# EAGLE design GSRv3.2 (EAGLE 7.4.0)
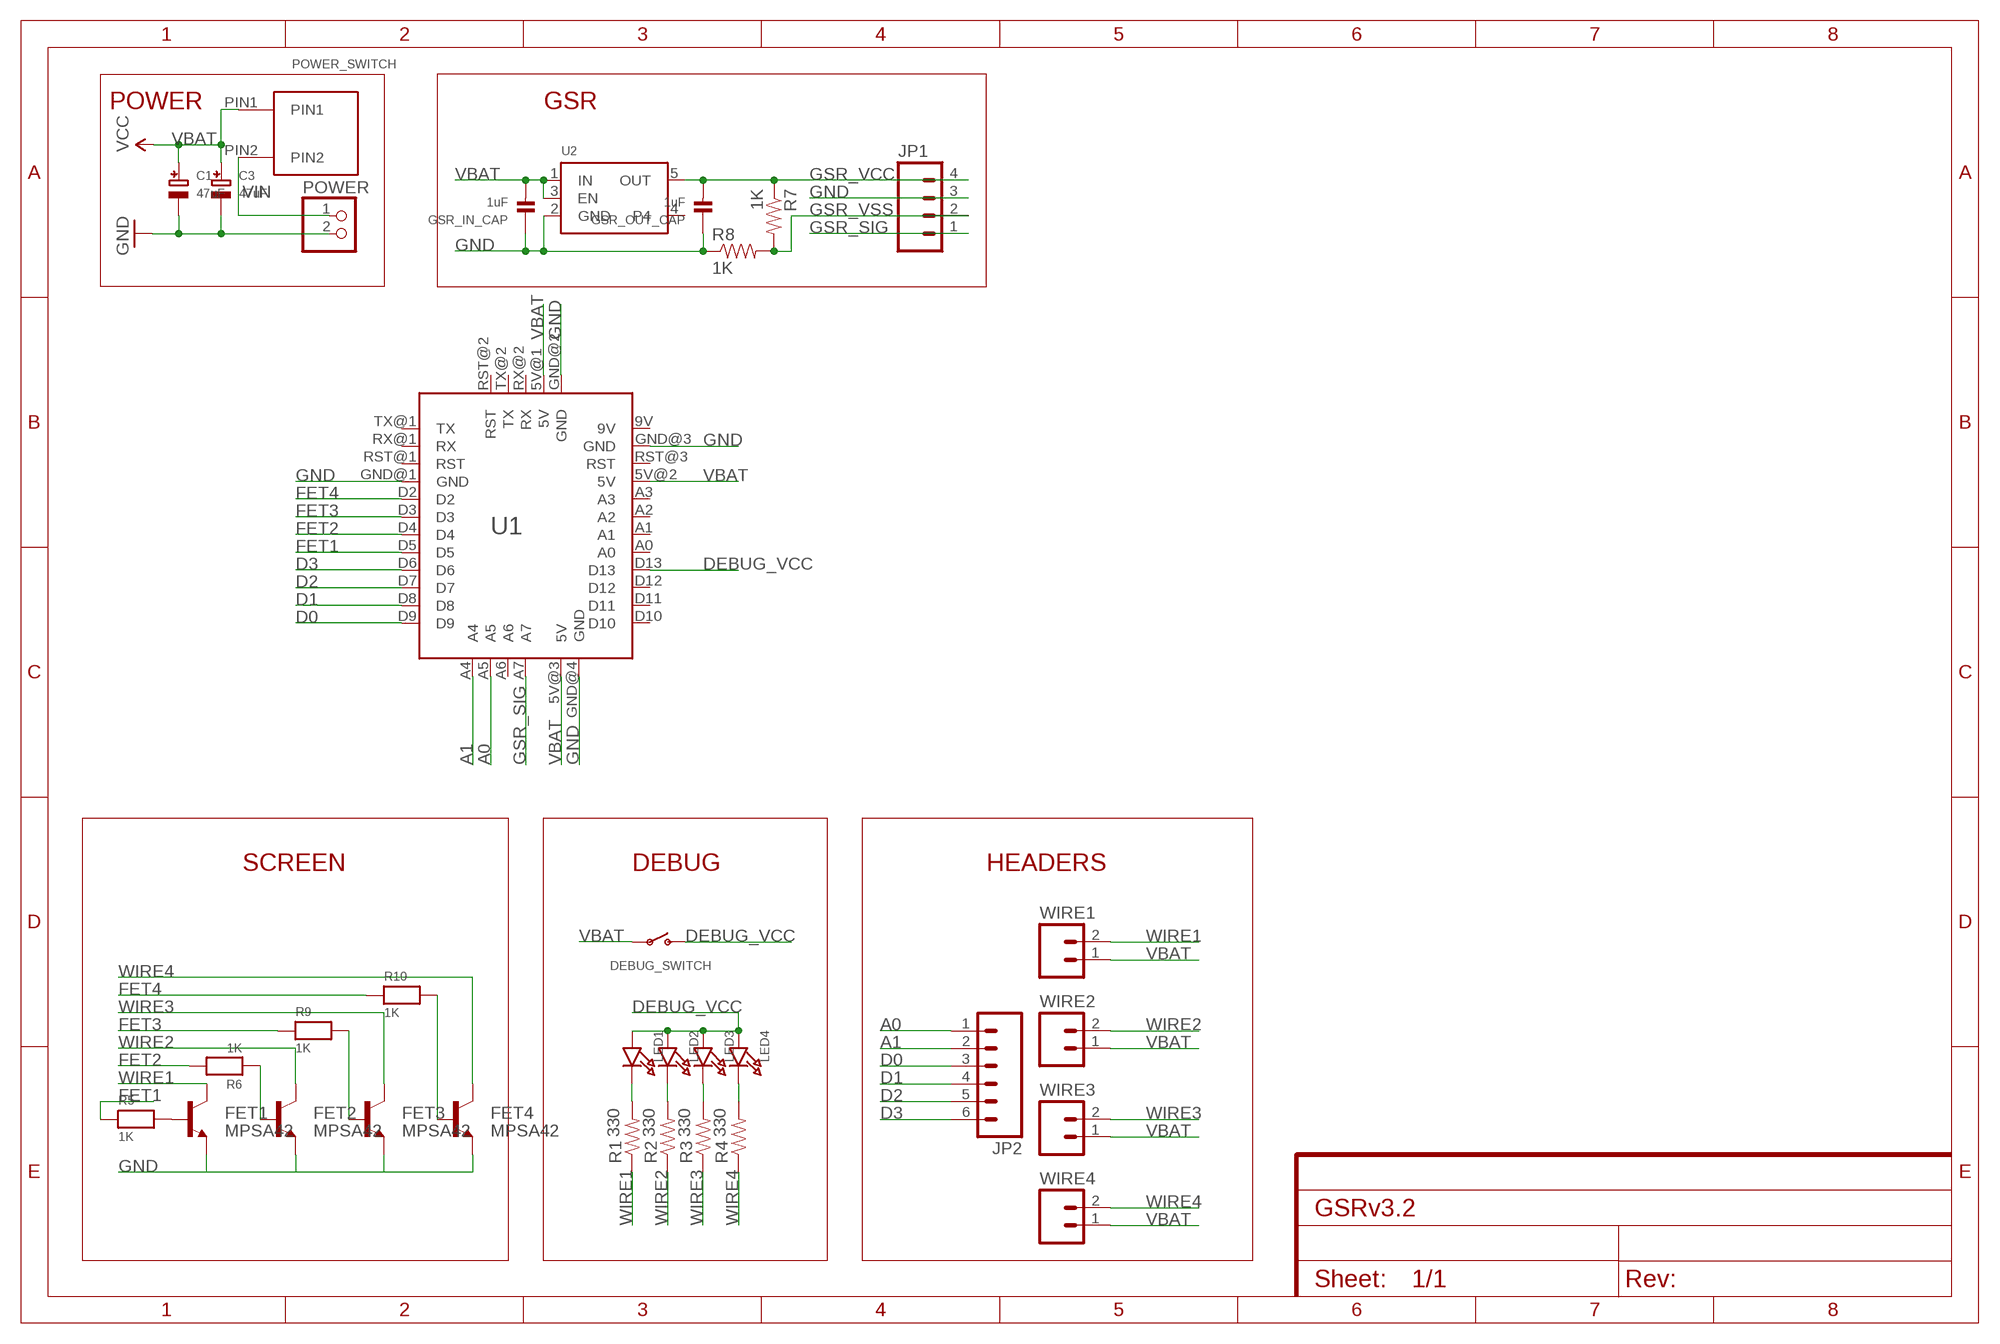
[diagram p0: schematic, sheet 1]

## Parts
C1  47uF  CAP_TANTALUMB/3528_WAVE  [EIA3528-21/B-W]
C3  47uF  CAP_TANTALUMB/3528_WAVE  [EIA3528-21/B-W]
DEBUG_SWITCH  SWITCH_SPST  [SPST_SMT_19192]
FET1  MPSA42  TRANSISTOR_NPNMPSA42  [SOT23-3]
FET2  MPSA42  TRANSISTOR_NPNMPSA42  [SOT23-3]
FET3  MPSA42  TRANSISTOR_NPNMPSA42  [SOT23-3]
FET4  MPSA42  TRANSISTOR_NPNMPSA42  [SOT23-3]
GSR_IN_CAP  1uF  CAP_CERAMIC0603  [0603]
GSR_OUT_CAP  1uF  CAP_CERAMIC0603  [0603]
JP1  M04POLAR  [MOLEX-1X4]
JP2  M06SILK_FEMALE_PTH  [1X06]
LED1  LED0603_NOOUTLINE  [CHIPLED_0603_NOOUTLINE]
LED2  LED0603_NOOUTLINE  [CHIPLED_0603_NOOUTLINE]
LED3  LED0603_NOOUTLINE  [CHIPLED_0603_NOOUTLINE]
LED4  LED0603_NOOUTLINE  [CHIPLED_0603_NOOUTLINE]
POWER  JST_2PIN  [JSTPH2]
POWER_SWITCH  PUSH_BUTTON  [PUSH_BUTTON]
R1  330  RESISTOR0603-RES  [0603-RES]
R2  330  RESISTOR0603-RES  [0603-RES]
R3  330  RESISTOR0603-RES  [0603-RES]
R4  330  RESISTOR0603-RES  [0603-RES]
R5  1K  RESISTOR0603  [0603]
R6  1K  RESISTOR0603  [0603]
R7  1K  0OHM-1/10W-5%(0603)  [0603]
R8  1K  0OHM-1/10W-5%(0603)  [0603]
R9  1K  RESISTOR0603  [0603]
R10  1K  RESISTOR0603  [0603]
U1  ARDUINO_MINI  [ARDUINO_MINI]
U2  VREG_SOT23-5  [SOT23-5]
WIRE1  M02POLAR  [MOLEX-1X2]
WIRE2  M02POLAR  [MOLEX-1X2]
WIRE3  M02POLAR  [MOLEX-1X2]
WIRE4  M02POLAR  [MOLEX-1X2]

## Nets
A0: JP2.1 U1.A5
A1: JP2.2 U1.A4
D0: JP2.3 U1.D9
D1: JP2.4 U1.D8
D2: JP2.5 U1.D7
D3: JP2.6 U1.D6
DEBUG_VCC: DEBUG_SWITCH.C(S) LED1.A LED2.A LED3.A LED4.A U1.D13
FET1: R5.1 U1.D5
FET2: R6.2 U1.D4
FET3: R9.1 U1.D3
FET4: R10.1 U1.D2
GND: C1.- C3.- FET1.2(E) FET2.2(E) FET3.2(E) FET4.2(E) GSR_IN_CAP.1 GSR_OUT_CAP.1 JP1.3 POWER.2 R8.1 U1.GND@1(GND) U1.GND@2(GND) U1.GND@3(GND) U1.GND@4(GND) U2.2(GND)
GSR_SIG: JP1.1 U1.A7
GSR_VCC: GSR_OUT_CAP.2 JP1.4 R7.1 U2.5(OUT)
GSR_VSS: JP1.2 R7.2 R8.2
N$1: LED1.C R1.2
N$2: LED2.C R2.2
N$3: LED3.C R3.2
N$4: LED4.C R4.2
N$5: FET1.1(B) R5.2
N$6: FET2.1(B) R6.1
N$7: FET3.1(B) R9.2
N$8: FET4.1(B) R10.2
VBAT: C1.+ C3.+ DEBUG_SWITCH.B(P) GSR_IN_CAP.2 POWER_SWITCH.PIN1 U1.5V@1(5V) U1.5V@2(5V) U1.5V@3(5V) U2.1(IN) U2.3(EN) WIRE1.1 WIRE2.1 WIRE3.1 WIRE4.1 ; supply symbol labelled VCC
VIN: POWER.1 POWER_SWITCH.PIN2
WIRE1: FET1.3(C) R1.1 WIRE1.2
WIRE2: FET2.3(C) R2.1 WIRE2.2
WIRE3: FET3.3(C) R3.1 WIRE3.2
WIRE4: FET4.3(C) R4.1 WIRE4.2
Unconnected: U1.A0 U1.A1 U1.A2 U1.A3 U1.A6 U1.D10 U1.D11 U1.D12 U1.RST@1(RST) U1.RST@2(RST) U1.RST@3(RST) U1.RX@1(RX) U1.RX@2(RX) U1.TX@1(TX) U1.TX@2(TX) U2.4

## Notes on the sheet
- POWER | GSR
- SCREEN | DEBUG | HEADERS

## Power pins joined to a net without a drawn wire
9V: U1.9V

## Library data of the parts
C1 C3 = microbuilder:CAP_TANTALUM: Tantalum Capacitors Wave footprints have larger pads and are meant to be used for hand soldering. Reflow footprints are optimised for solder paste and a reflow oven. EIA3216-18/A-[R/W] - Size A / 3216-18 / 1206 footprint 4.7µF 25V 10% Tantalum Capacitor 10µF 16V 10% Tantalum Capacitor [Digikey: 495-2236-2-ND] EIA3528-21/B-[R/W] - Size B / 3528-21 47µF 10V 10% Tantalum Capactior [Digikey: 495-2216-1-ND] EIA6032-28/C-[R/W] - Size C / 6032-28 10µF 35V 20% Tantalum Capacitor [Digikey: 495-2285-1-ND] 100µF 16V 10% Tantalum Capactior [Digikey: 399-5214-1-ND]
DEBUG_SWITCH = microbuilder:SWITCH_SPST: Switch - SPST 4UCon 19192 (6.7x2.6mm SMT)
FET1-FET4 = SparkFun-DiscreteSemi:TRANSISTOR_NPN: Generic NPN BJT MMBT2222A - TRANS-08049 (SOT-23, 1A 40V) MPSA42 - TRANS-09116 (SOT-23, 500mA 300V) MMBT5088LT1G - TRANS-11160 (SOT-23, 50 mA 30V) BC547 - COM-08928 <http://www.sparkfun.com/products/8928> (TO-92 45V 100mA) (1.Collector 2.Base 3.Emitter) 2N3904 - COM-00521 <http://www.sparkfun.com/products/521> (TO-92 40V 200mA) (1.Emitter 2.Base 3.Collector) P2N2222A - COM-12852 <http://www.sparkfun.com/products/12852> (TO-92 40V 600mA) (1.Collector 2.Base 3.Emitter); PROD_ID: TRANS-09116
GSR_IN_CAP GSR_OUT_CAP = microbuilder:CAP_CERAMIC: Ceramic Capacitors 0402 - 0402 Surface Mount Capacitors 16pF 50V 5% [Digikey: 445-4899-2-ND] 18pF 50V 5% [Digikey: 490-1281-2-ND] 22pF 50V 5% [Digikey: 490-1283-2-ND] 68pF 50V 5% [Digikey: 490-1289-2-ND] 0.1uF 10V 10% [Digikey: 490-1318-2-ND] 1.0uF 6.3V 10% [Digikey: 490-1320-2-ND] 0603 - 0603 Surface Mount Capacitors 16 pF 50V 5% [Digikey: 445-5051-2-ND] 22 pF 50V [Digikey: PCC220ACVTR-ND] 33 pF 50V 5% [Digikey: 490-1415-1-ND] 56pF 50V 5% [Digikey: 490-1421-1-ND] 220pF 50V 5% [Digikey: 445-1285-1-ND] 680 pF 50V 2200 pF 50V 5% C0G [Digikey: 445-1297-1-ND] 5600 pF 100V 5% X7R [Digikey: 478-3711-1-ND] 0.1 µF 25V 10% [Digikey: PCC2277TR-ND] 0.22 µF 16V 10% X7R [Digikey: 445-1318-1-ND] 1.0 µF 25V 10% [Digikey: 445-5146-2-ND] 0603 - RF Specific 3pF 250V +/-0.1pF RF [Digikey: 712-1347-1-ND] 18 pF 250V 5% [Digikey: 478-3505-1-ND or 712-1322-1-ND] 56 pF 250V 5% C0G RF [Digikey: 490-4867-1-ND] 68 pF 250V RF [Digikey: 490-4868-1-ND] 0805 - 0805 Surface Mount Capacitors 220 pF 250V 2% RF Ceramic Capacitor [Digikey: 712-1398-1-ND] 1000 pF 50V 2% NP0 Ceramic Capacitor [Digikey: 478-3760-1-ND] 0.1 µF 25V 10% Ceramic Capacitor [Digikey: PCC1828TR-ND] 1.0 µF 16V 10% Ceramic Capacitor[Digikey: 490-1691-2-ND] 10.0 µF 10V 10% Ceramic Capacitor[Digikey: 709-1228-1-ND] 10.0 uF 16V 10% Ceramic Capacitor [Digikey: 478-5165-2-ND] 47 uF 6.3V 20% Ceramic Capacitor [Digikey: 587-1779-1-ND or 399-5506-1-ND] 1206 - 1206 Surface Mount Capacitors 47uF 10V 20% Ceramic Capacitor [Digikey: 490-5528-1-ND or 399-5508-1-ND or 445-6010-1-ND] 100uF 6.3V -20%, +80% Y5V Ceramic Capacitor (Digikey: 490-4512-1-ND, Mouser: 81-GRM31CF50J107ZE1L)
JP1 = SparkFun-Connectors:M04: Header 4 Standard 4-pin 0.1" header. Use with straight break away headers (SKU : PRT-00116), right angle break away headers (PRT-00553), swiss pins (PRT-00743), machine pins (PRT-00117), and female headers (PRT-00115). Molex polarized connector foot print use with SKU : PRT-08231 with associated crimp pins and housings. 1MM SMD Version SKU: PRT-10208
JP2 = SparkFun-Connectors:M06: Header 6 Standard 6-pin 0.1" header. Use with straight break away headers (SKU : PRT-00116), right angle break away headers (PRT-00553), swiss pins (PRT-00743), machine pins (PRT-00117), and female headers (PRT-00115). Molex polarized connector foot print use with SKU : PRT-08094 with associated crimp pins and housings. NOTES ON THE VARIANTS LOCK and LOCK_LONGPADS... This footprint was designed to help hold the alignment of a through-hole component (i.e. 6-pin header) while soldering it into place. You may notice that each hole has been shifted either up or down by 0.005 of an inch from it's more standard position (which is a perfectly straight line). This slight alteration caused the pins (the squares in the middle) to touch the edges of the holes. Because they are alternating, it causes a "brace" to hold the component in place. 0.005 has proven to be the perfect amount of "off-center" position when using our standard breakaway headers. Although looks a little odd when you look at the bare footprint, once you have a header in there, the alteration is very hard to notice. Also,if you push a header all the way into place, it is covered up entirely on the bottom side. This idea of altering the position of holes to aid alignment will be further integrated into the Sparkfun Library for other footprints. It can help hold any component with 3 or more connection pins.; PROD_ID: CONN-08437
LED1-LED4 = microbuilder:LED: LED 0603 - 0603 Surface Mount Package 2mA: Green LED - Low Power (3.9mcd, 2ma, 1.7Vf) - Digikey: 475-2709-2-ND Orange LED - Low Power (9.8mcd, 2ma, 1.8Vf) - Digikey: 475-1194-2-ND Red LED - Low Power (5mcd, 2ma, 1.8Vf) - Digikey: 475-1195-2-ND Yellow LED - Low Power (7mcd, 2ma, 1.8Vf) - Digikey: 475-1196-2-ND 5mA: Blue LED - Low Power (17mcd, 5ma, 2.9Vf) - Digikey: LNJ937W8CRACT-ND 0805 - 0805 Surface Mount Package 2mA: Red LED (8.8mcd, 2mA, 1.8Vf, Clear) - Low Power [Digikey: 475-2510-1-ND] Green LED (5mcd, 2mA, 1.8Vf, Clear) - Low Power [Digikey: 475-2730-1-ND] Yellow LED (11.3mcd, 2mA, 1.8Vf, Clear) - Low Power [Digikey: 475-2555-1-ND] 20mA: Red LED (104mcd, 20mA, Diffused) - LS R976 [Digikey: 475-1278-6-ND] Red LED (12mcd, 20mA, 2.0Vf, Clear) - APT2012EC [Digikey: 754-1128-1-ND] Green LED (15mcd, 20mA, 2.2Vf, Clear) - APT2012GC [Digikey: 754-1131-1-ND] Orange LED (160mcd, 20mA, 2.1Vf, Clear) - APT2012SECK [Digikey: 754-1130-1-ND] 1206 - 1206 Surface Mount Package Green LED (26mcd, 20mA, Diffused) - LG N971 [Digikey: 475-1407-6-ND] Red LED (15mcd, 20mA, Diffused) - LH N974 [Digikey: 475-1416-6-ND]
POWER = microbuilder:JST_2PIN: JST 2-Pin Right-Angle Connector PH-Series - 4UConnector: 17311 SH-Series - 4UConnector: 07278
POWER_SWITCH = myParts:PUSH_BUTTON
R1-R4 = SparkFun-Passives:RESISTOR: Resistor Basic schematic elements and footprints for 0603, 1206, and PTH resistors.
R5 R6 R9 R10 = microbuilder:RESISTOR: Resistors 0402 - 0402 Surface Mount Package 22 Ohm 1% 1/16W [Digikey: 311-22.0LRTR-ND] 33 Ohm 5% 1/16W 1.0K 5% 1/16W 1.5K 5% 1/16W 2.0K 1% 1/16W 10.0K 1% 1/16W [Digikey: 311-10.0KLRTR-ND] 10.0K 5% 1/16W [Digikey: RMCF0402JT10K0TR-ND] 12.1K 1% 1/16W [Digikey: 311-22.0LRTR-ND] 100.0K 5% 1/16W 0603 - 0603 Surface Mount Package 0 Ohm 1/10 Watt 1% Resistor 15 Ohm 1/10 Watt 1% Resistor 33 Ohm 1/10 Watt 1% Resistor 49.9 Ohm 1/10 Watt 1% Resistor 100 Ohm 1/10 Watt 1% Resistor 150 Ohm 1/10 Watt 1% Resistor 240 Ohm 1/10 Watt 1% Resistor 390 Ohm 1/10 Watt 1% Resistor 560 Ohm 1/10 Watt 1% Resistor 680 Ohm 1/10 Watt 1% Resistor 750 Ohm 1/10 Watt 1% Resistor 1.0K Ohm 1/10 Watt 1% Resistor 1.5K Ohm 1/10 Watt 1% Resistor 2.0K Ohm 1/10 Watt 1% Resistor 2.2K Ohm 1/10 Watt 1% Resistor 3.3K Ohm 1/10 Watt 1% Resistor 4.7K Ohm 1/10 Watt 1% Resistor 10.0K Ohm 1/10 Watt 1% Resistor 12.0K Ohm 1/10 Watt 1% Resistor 12.1K Ohm 1/10 Watt 1% Resistor 20.0K Ohm 1/10 Watt 1% Resistor 33.0K Ohm 1/10 Watt 1% Resistor 100.0K Ohm 1/10 Watt 1% Resistor 0805 - 0805 Surface Mount Package 0 Ohm 1/8 Watt 1% Resistor 33 Ohm 1/8 Watt 1% Resistor 100 Ohm 1/8 Watt 1% Resistor 150 Ohm 1/8 Watt 1% Resistor 200 Ohm 1/8 Watt 1% Resistor 240 Ohm 1/8 Watt 1% Resistor 330 Ohm 1/8 Watt 1% Resistor 390 Ohm 1/8 Watt 1% Resistor 470 Ohm 1/8 Watt 1% Resistor 1.0K Ohm 1/8 Watt 1% Resistor 1.5K Ohm 1/8 Watt 1% Resistor 2.0K Ohm 1/8 Watt 1% Resistor 4.7K Ohm 1/8 Watt 1% Resistor 5.1K Ohm 1/8 Watt 1% Resistor 5.6K Ohm 1/8 Watt 1% Resistor 10.0K Ohm 1/8 Watt 1% Resistor 22.0K Ohm 1/8 Watt 1% Resistor 33.0K Ohm 1/8 Watt 1% Resistor 100K Ohm 1/8 Watt 1% Resistor 1206 - 1206 Surface Mount Package 2012 - 2010 Surface Mount Package 0.11 Ohm 1/2 Watt 1% Resistor - Digikey: RHM.11UCT-ND
R7 R8 = SparkFun-Resistors:0OHM-1/10W-5%(0603): RES-08609; PROD_ID: RES-08609; VALUE: 0
U1 = myParts:ARDUINO_MINI: Arduino Mini V5 Footprint
U2 = microbuilder:VREG_SOT23-5: SOT23-5 Fixed Voltage Regulators To better organise some of the SOT23-5 fixed voltage regulators in this library, this new part was created. Part Current Out V Out V In V Dropout Digikey Part No. ADP121 150mA 3.3V 3.4-5.5V 0.09V @ 150mA ADP121-AUJZ33R7CT-ND ADP121 150mA 3.0V 3.1-5.5V 0.09V @ 150mA ADP121-AUJZ30R7CT-ND ADP122 300mA 3.3V 3.4-5.5V 0.085V @ 300mA ADP122AUJZ-3.3-R7CT-ND ADP1712 300mA 3.3V 3.5-5.5V 0.17V @ 300mA ADP1712AUJZ-3.3-R7TR-ND AP7311 (Low Cost) 150mA 3.3V 3.5-6V 0.15V @ 150mA AP7311-33WG-7DICT-ND LD39015M18R 150mA 1.8V 1.9V-5.5V 0.08V @ 100mA 497-6977-1-ND MCP1824T-3302E/OT 300mA 3.3V 3.5V-6V 0.2V @ 300mA MCP1824T-3302E/OTCT-ND MIC5205-2.5YM5 TR 150mA 2.5V 2.7-16V 0.165V @ 150mA 576-1257-2-ND MIC5205-3.0YM5 TR 150mA 3.0V 3.2V-16V 0.165V @ 150mA 576-1258-2-ND MIC5205-3.3YM5 TR 150mA 3.3V 3.5V-16V 0.165V @ 150mA 576-1259-2-ND TPS780330220 150mA 3.3V+2.2V 3.6-5.5V 250mV Max 296-23332-1-ND TDA3663/N1,135 100mA 3.3V 3.5-45V 0.18V @ 50mA 568-5343-1-ND
WIRE1-WIRE4 = SparkFun-Connectors:M02: Standard 2-pin 0.1" header. Use with - straight break away headers ( PRT-00116) - right angle break away headers (PRT-00553) - swiss pins (PRT-00743) - machine pins (PRT-00117) - female headers (PRT-00115) Molex polarized connector foot print use with: PRT-08233 with associated crimp pins and housings. 2.54_SCREWTERM for use with PRT-10571. 3.5mm Screw Terminal footprints for PRT-08084 5mm Screw Terminal footprints for use with PRT-08432

## Board
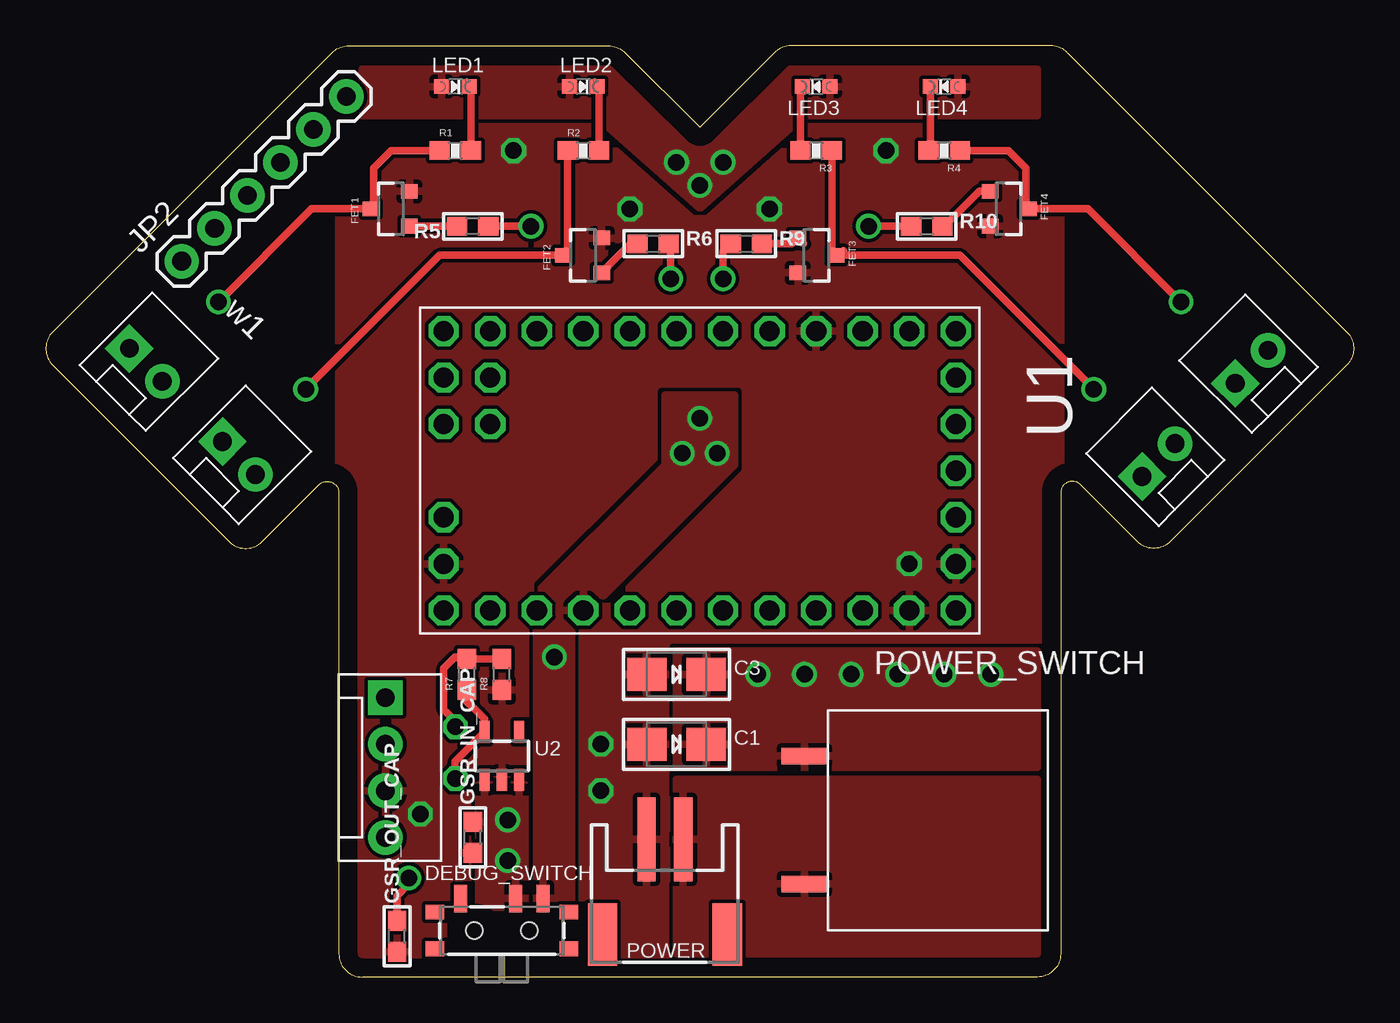
[diagram p1: board, top side]
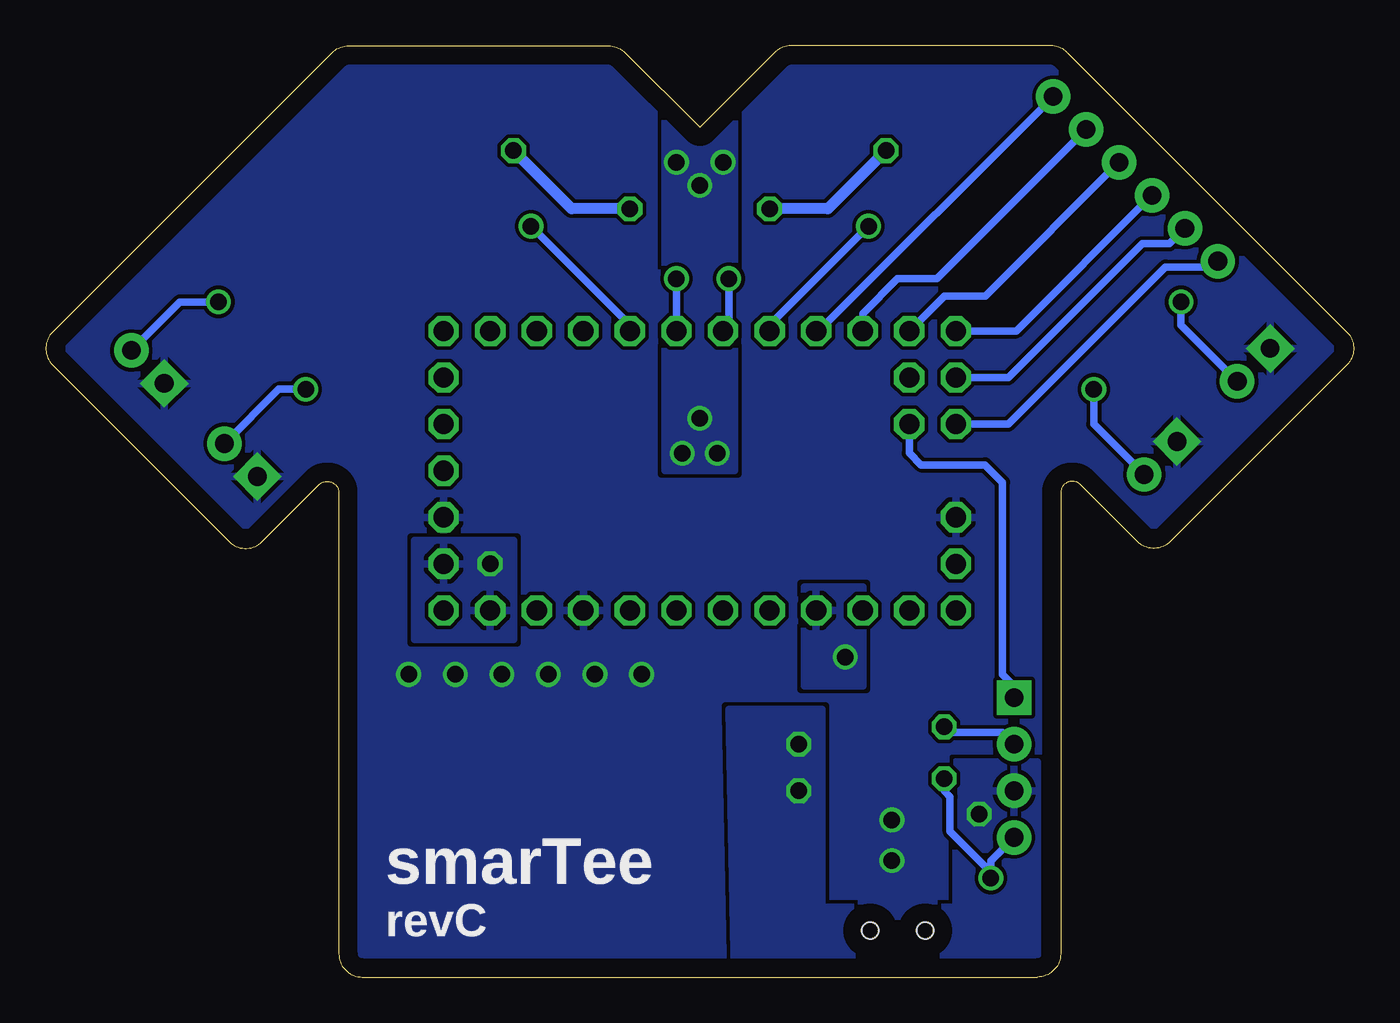
[diagram p2: board, bottom side, seen from below]

Size 71.34 x 50.8 mm. Coordinates in mm from the lower left corner, seen from the top.
Outline: 56.44,26.86 arc135 55.35,26.41 55.35,1.27 arc-90 54.08,0 17.25,0 arc-90 15.98,1.27 15.98,26.41 arc135 14.9,26.86 11.8,23.76 arc-90 10,23.76 0.37,33.39 arc-90 0.37,35.19 15.61,50.43 arc-45 16.51,50.8 30.7,50.8 arc-45 31.59,50.43 35.67,46.36 39.74,50.43 arc-45 40.64,50.8 54.83,50.8 arc-45 55.72,50.43 70.96,35.19 arc-90 70.96,33.39 61.33,23.76 arc-90 59.53,23.76 56.44,26.86
Copper layers (1*16): Top 0.035mm / dielectric 1.5mm / Bottom 0.035mm
Design rules "default": minimum track width 10mil, minimum drill 24mil, track to track 8mil, track to pad 8mil, pad to pad 8mil, via to via 8mil, smd to smd 8mil, copper to edge 40mil, drill to drill 8mil, minimum pad ring 10mil, minimum via ring 8mil, stop-mask expansion 4mil, vias tented up to drill 0mil, thermal gap 10mil

### Footprints (pad centres in the part's own frame; a part is rotated, then mirrored left to right if it is on the bottom)
EIA3528-21/B-W = smd 2.15 x 1.8: + 1.625,0; - -1.625,0
SPST_SMT_19192 = smd 0.7 x 1.5: A -2.25,1.75; B 0.75,1.75; C 2.25,1.75 | smd 1 x 0.8: GND1 -3.65,1; GND2 -3.65,-1; GND3 3.65,1; GND4 3.65,-1 | hole 0.9: -1.5,0; 1.5,0
SOT23-3 = smd 0.8 x 0.9: 1 -0.95,-1; 2 0.95,-1; 3 0,1.1
0603 = smd 1.1 x 1: 1 -0.85,0; 2 0.85,0
MOLEX-1X4 = drill 1.016 pad 1.88 square: 1 0,0 | drill 1.016 pad 1.88: 2 2.54,0; 3 5.08,0; 4 7.62,0
1X06 = drill 1.016 pad 1.88: 1 0,0; 2 2.54,0; 3 5.08,0; 4 7.62,0; 5 10.16,0; 6 12.7,0
CHIPLED_0603_NOOUTLINE = smd 0.8 x 0.8: A 0,-0.75; C 0,0.75
JSTPH2 = smd 1 x 4.6: 1 -1,-3.7; 2 1,-3.7 | smd 1.6 x 3.4: NC1 -3.4,1.5; NC2 3.4,1.5
PUSH_BUTTON = smd 2.5 x 0.9: PIN1 -13.97,-0.644; PIN2 -13.97,-7.62
0603-RES = smd 1.1 x 1: 1 -0.85,0; 2 0.85,0
ARDUINO_MINI = drill 1.1 octagon: 5V@1 2.54,15.24; 5V@2 7.62,7.62; 5V@3 2.54,-12.7; 9V 7.62,15.24; A0 7.62,-2.54; A1 7.62,0; A2 7.62,2.54; A3 7.62,5.08; A4 -5.08,-12.7; A5 -2.54,-12.7; A6 -5.08,-10.16; A7 -2.54,-10.16; D2 -7.62,5.08; D3 -7.62,2.54; D4 -7.62,0; D5 -7.62,-2.54; D6 -7.62,-5.08; D7 -7.62,-7.62; D8 -7.62,-10.16; D9 -7.62,-12.7; D10 7.62,-12.7; D11 7.62,-10.16; D12 7.62,-7.62; D13 7.62,-5.08; GND@1 -7.62,7.62; GND@2 5.08,15.24; GND@3 7.62,12.7; GND@4 5.08,-12.7; RST@1 -7.62,10.16; RST@2 -5.08,15.24; RST@3 7.62,10.16; RX@1 -7.62,12.7; RX@2 0,15.24; TX@1 -7.62,15.24; TX@2 -2.54,15.24
SOT23-5 = smd 0.55 x 1.2: 1 -0.95,-1.3; 2 0,-1.3; 3 0.95,-1.3; 4 0.95,1.3; 5 -0.95,1.3
MOLEX-1X2 = drill 1.016 pad 1.88 square: 1 0,0 | drill 1.016 pad 1.88: 2 2.54,0

### Placement (x,y rotation side)
C1  34.4,12.7 0 top
C3  34.4,16.51 0 top
DEBUG_SWITCH  24.87,2.54 0 top
FET1  18.84,41.91 90 top
FET2  29.32,39.37 90 top
FET3  42.02,39.37 270 top
FET4  52.5,41.91 270 top
GSR_IN_CAP  23.29,7.62 90 top
GSR_OUT_CAP  19.16,2.22 90 top
JP1  18.52,15.24 270 top
JP2  7.41,39.05 45 top
LED1  22.33,48.58 270 top
LED2  29.32,48.58 270 top
LED3  42.02,48.58 90 top
LED4  49,48.58 90 top
POWER  33.76,3.81 180 top
POWER_SWITCH  55.35,12.7 0 top
R1  22.33,45.09 0 top
R2  29.32,45.09 0 top
R3  42.02,45.09 180 top
R4  49,45.09 180 top
R5  23.29,40.96 180 top
R6  33.13,40.01 0 top
R7  22.97,16.51 90 top
R8  24.87,16.51 90 top
R9  38.21,40.01 0 top
R10  48.05,40.96 0 top
U1  34.4,27.62 270 top
U2  24.87,12.06 0 top
WIRE1  4.55,34.29 315 top
WIRE2  9.63,29.21 315 top
WIRE3  59.8,27.3 45 top
WIRE4  64.88,32.38 45 top

### Tracks (layer width: path | path; a pad name or v marks a point on that pad's centre or on a via)
A0
  Bottom 0.406: U1.A5 18.84,30.16 10.27,38.74 7.73,38.74 JP2.1
A1
  Bottom 0.406: U1.A4 18.84,32.7 11.54,40.01 10.05,40.01 JP2.2
D0
  Bottom 0.406: U1.D9 18.4,35.24 JP2.3
D1
  Bottom 0.406: U1.D8 22.33,37.15 20.09,37.15 JP2.4
D2
  Bottom 0.406: U1.D7 26.78,36.2 24.87,38.1 22.73,38.1 JP2.5
D3
  Bottom 0.406: U1.D6 29.18,35.24 JP2.6
DEBUG_VCC  (via drill 0.9)
  other vias: 35.67,30.48 34.72,28.57 36.62,28.57 35.67,43.18 34.4,44.45 36.94,44.45 27.73,17.46
  pour Bottom: 37.57,27.62 37.57,49.53 33.76,49.53 33.76,27.62
  pour Top: 35.67,41.91 41.38,46.99 54.08,46.99 54.08,49.53 17.25,49.53 17.25,46.99 29.95,46.99
  pour Top: 26.78,3.81 26.78,20.32 28.68,20.32 28.68,3.81
  pour Top: 33.76,31.75 37.57,31.75 37.57,27.94 28.68,19.05 26.14,19.05 26.14,20.32 33.76,27.94
  pour Bottom: 26.78,21.27 29.95,21.27 29.95,15.88 26.78,15.88
FET1  (via drill 0.9)
  Top 0.406: v26.46,40.96 R5.1
  Bottom 0.406: U1.D5 31.86,35.56 v26.46,40.96
FET2  (via drill 0.9)
  Top 0.406: v34.08,38.1 34.08,39.9 R6.2
  Bottom 0.406: U1.D4 34.08,35.24 v34.08,38.1
FET3  (via drill 0.9)
  Top 0.406: v36.94,38.1 36.94,39.59 R9.1
  Bottom 0.406: U1.D3 v36.94,38.1
FET4  (via drill 0.9)
  Top 0.406: v44.88,40.96 R10.1
  Bottom 0.406: U1.D2 39.48,35.56 v44.88,40.96
GND  (via drill 0.9)
  Bottom 0.61: v31.86,41.91 28.68,41.91 v25.51,45.09 | v39.48,41.91 42.65,41.91 v45.83,45.09
  other vias: 30.27,10.16 30.27,12.7 47.1,22.54 20.43,8.89
  pour Top (rank 3): 15.98,55.88 55.35,55.88 55.35,-8.89 15.98,-8.89
  pour Bottom: 17.25,11.75 21.7,11.75 21.7,3.81 29,3.81 29,14.61 34.08,14.61 33.76,0 17.25,0
  pour Bottom: 51.23,23.81 45.83,23.81 45.83,18.41 51.23,18.41
GSR_SIG
  Bottom 0.406: JP1.1 18.52,15.88 19.16,16.51 19.16,26.99 20.11,27.94 23.6,27.94 24.24,28.57 U1.A7
GSR_VCC  (via drill 0.9)
  Top 0.406: R7.1 22.65,15.34 23.92,14.07 U2.5 22.33,11.78 v22.33,10.82 | GSR_OUT_CAP.2 19.16,4.45 19.79,5.08 v19.79,5.4
  Bottom 0.406: v22.33,10.82 22.33,10.16 22.01,9.84 22.01,7.94 19.79,5.71 | v19.79,5.4 19.79,5.71 | 19.79,5.71 19.79,6.35 JP1.4
GSR_VSS  (via drill 0.9)
  Top 0.406: 22.55,17.36 R7.2 | R7.2 R8.2 | v22.33,13.65 22.33,13.97 21.7,14.61 21.7,16.83 22.33,17.46 22.87,17.46 R7.2
  Bottom 0.406: v22.33,13.65 22.01,13.33 19.16,13.33 JP1.2
N$1
  Top 0.406: R1.2 23.18,48.48 LED1.C
N$2
  Top 0.406: R2.2 30.17,48.48 LED2.C
N$3
  Top 0.406: R3.2 41.17,48.48 LED3.C
N$4
  Top 0.406: R4.2 48.25,45.19 LED4.C
N$5
  Top 0.406: R5.2 FET1.1
N$6
  Top 0.406: R6.1 31.9,40.01 FET2.1
N$7
  Top 0.406: 41.34,40.01 FET3.1 40.7,40.01 R9.2
N$8
  Top 0.406: R10.2 49,40.96 50.91,42.86 FET4.1
VBAT  (via drill 0.9)
  other vias: 25.19,8.57 25.19,6.35 43.92,16.51 41.38,16.51 38.84,16.51 46.46,16.51 49,16.51 51.54,16.51
  pour Bottom (rank 2): -4.34,54.61 79.48,54.61 79.48,-3.81 -4.34,-3.81
  pour Top: 54.08,17.78 34.4,17.78 34.4,11.43 54.08,11.43
  pour Top: 26.14,10.48 23.6,10.48 23.6,3.81 26.14,3.81
VIN
  pour Top: 54.08,10.79 34.4,10.79 34.4,1.27 54.08,1.27
WIRE1  (via drill 0.9)
  Top 0.406: v9.41,36.83 14.49,41.91 FET1.3 17.89,42.06 17.89,44.13 18.84,45.09 R1.1
  Bottom 0.406: v9.41,36.83 9.41,35.56 WIRE1.2
WIRE2  (via drill 0.9)
  Top 0.406: R2.1 28.47,39.62 FET2.3 21.48,39.37 v14.18,32.07
  Bottom 0.406: v14.18,32.07 14.18,30.16 WIRE2.2
WIRE3  (via drill 0.9)
  Top 0.406: 43.5,39.62 FET3.3 | FET3.3 49.86,39.37 v57.16,32.07 | R3.1 42.87,39.62 FET3.3
  Bottom 0.406: v57.16,32.07 58.63,32.07 WIRE3.2
WIRE4  (via drill 0.9)
  Top 0.406: v61.92,36.83 56.84,41.91 FET4.3 53.45,42.06 53.45,44.13 52.49,45.09 R4.1
  Bottom 0.406: v61.92,36.83 64.02,36.83 WIRE4.2

### Text on the board
bPlace: smarTee | revC
tSilk: w1